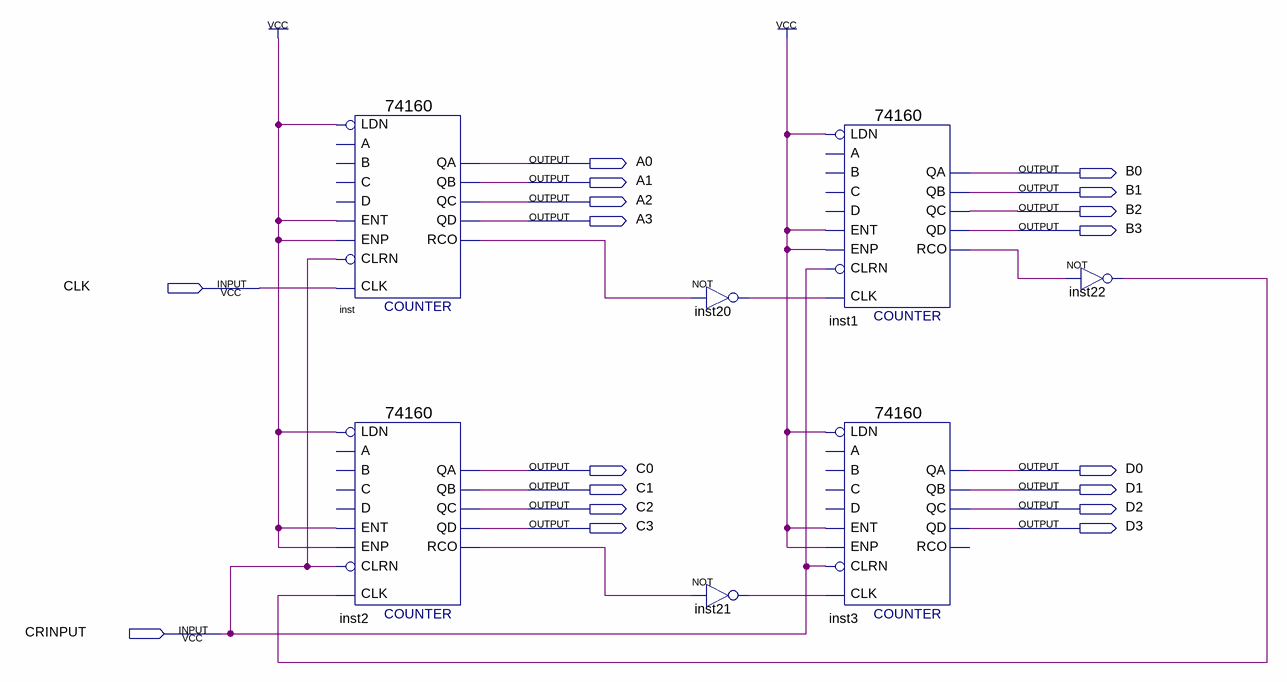
[diagram p0: schematic sheet]
// Quartus schematic counter.bdf as structural Verilog: 7 symbols, 18 pins
module counter (
  input  CLK,
  input  CRINPUT,
  output A0,
  output B0,
  output A1,
  output B1,
  output A2,
  output B2,
  output A3,
  output B3,
  output C0,
  output D0,
  output C1,
  output D1,
  output C2,
  output D2,
  output C3,
  output D3
);

  wire inst1_rco, inst2_rco, inst20_out, inst21_out, inst22_out, inst_rco;

  \74160  inst (
    .CLK(CLK), .ENT(1'b1), .LDN(1'b1), .ENP(1'b1), .CLRN(CRINPUT), .QD(A3), .QA(A0), .QB(A1), .QC(A2),
    .RCO(inst_rco));  // open: A, B, C, D
  \74160  inst2 (
    .CLK(inst22_out), .ENT(1'b1), .LDN(1'b1), .ENP(1'b1), .CLRN(CRINPUT), .QD(C3), .QA(C0), .QB(C1), .QC(C2),
    .RCO(inst2_rco));  // open: A, B, C, D
  not inst20 (inst20_out, inst_rco);
  not inst21 (inst21_out, inst2_rco);
  \74160  inst1 (
    .CLK(inst20_out), .ENT(1'b1), .LDN(1'b1), .ENP(1'b1), .CLRN(CRINPUT), .QD(B3), .QA(B0), .QB(B1), .QC(B2),
    .RCO(inst1_rco));  // open: A, B, C, D
  \74160  inst3 (
    .CLK(inst21_out), .ENT(1'b1), .LDN(1'b1), .ENP(1'b1), .CLRN(CRINPUT), .QD(D3), .QA(D0), .QB(D1), .QC(D2));  // open: A, B, C, D, RCO
  not inst22 (inst22_out, inst1_rco);
endmodule
